# EAGLE schematic LIC_rack_BB-01 (EAGLE 7.2.0)
AUTHOR: M. Petrilak; VERSION: 00

## Sheet 1 of 4
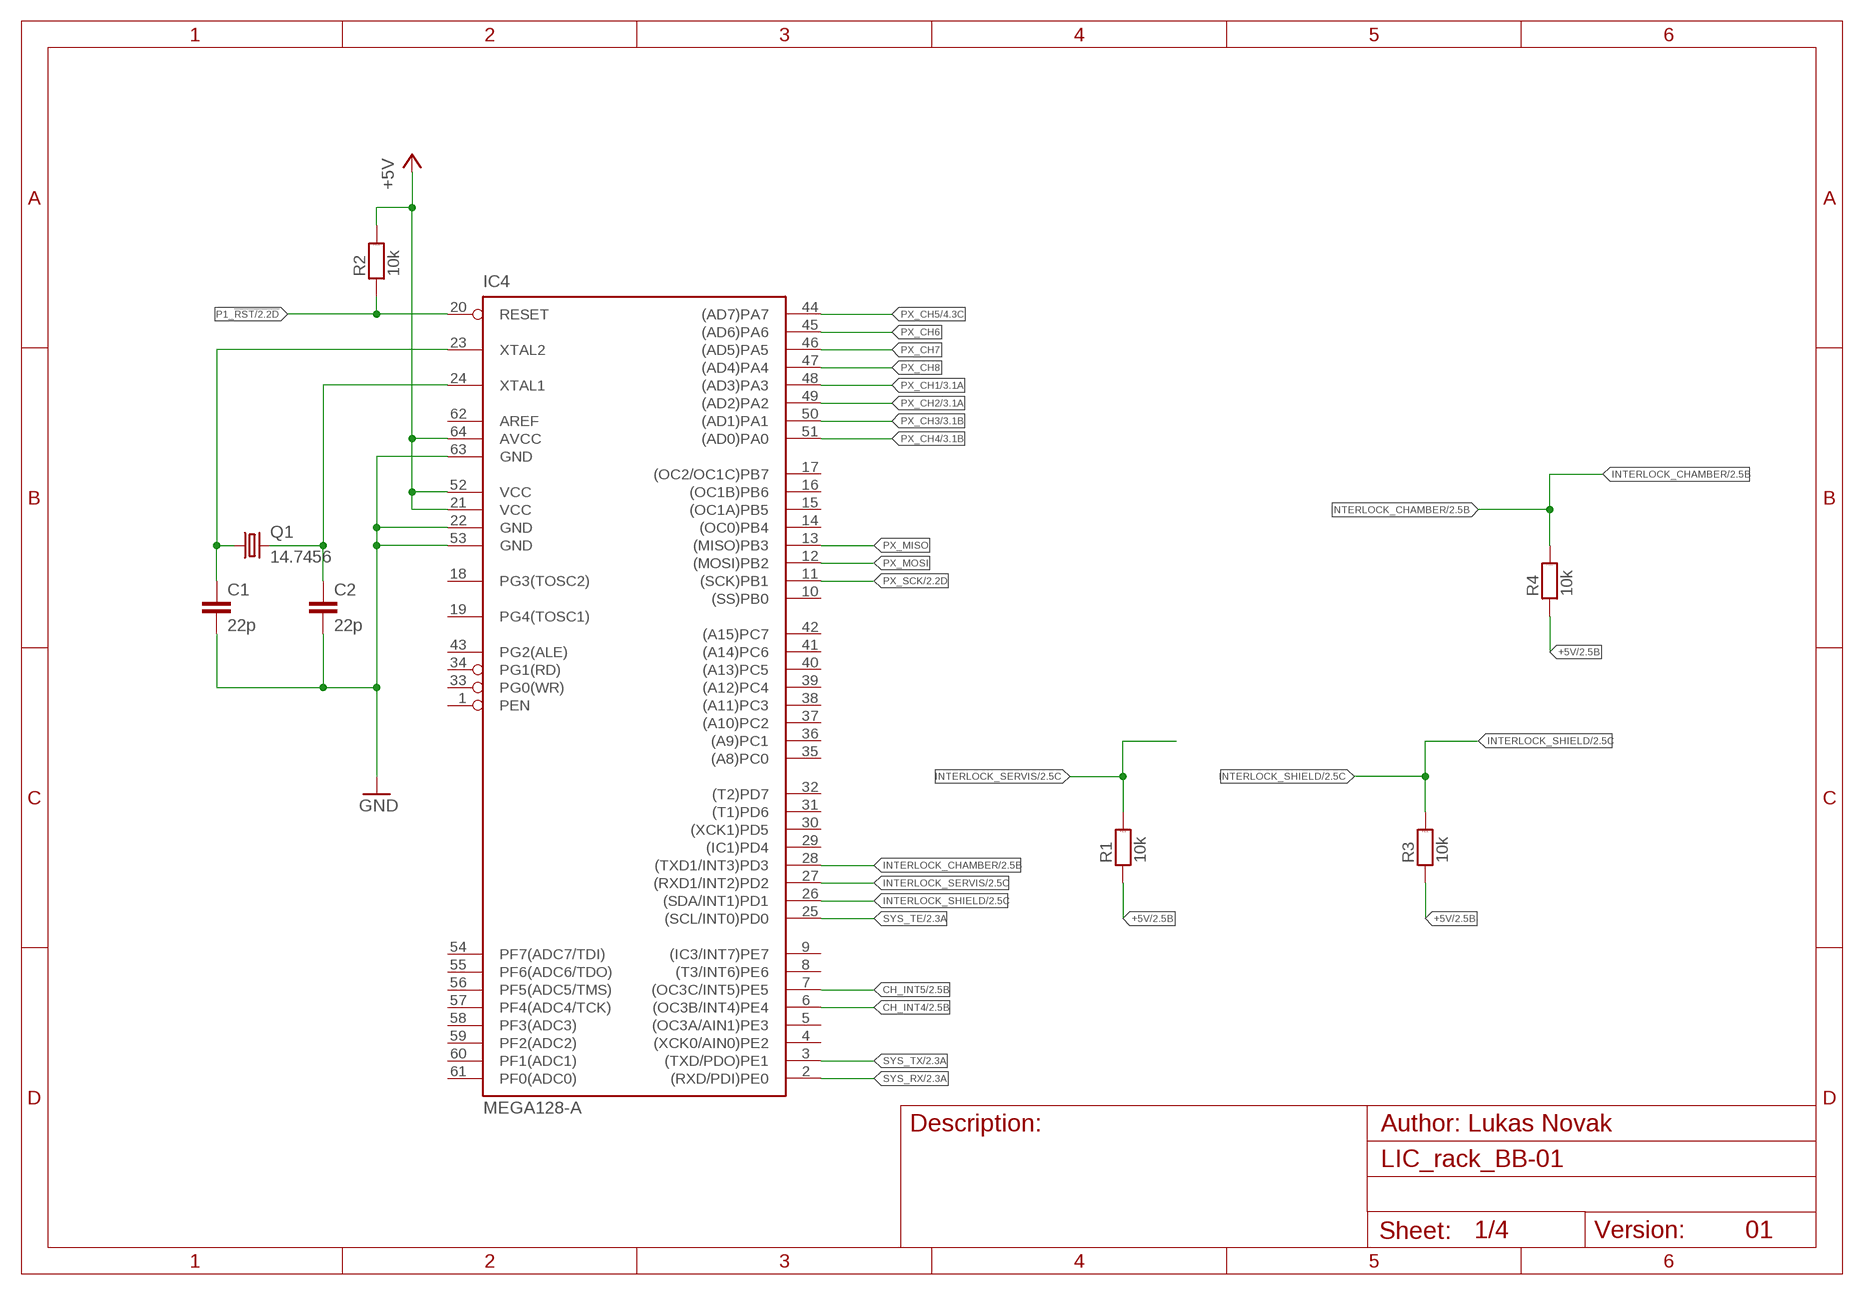
[diagram p0: schematic, sheet 1]

### Parts
C1  22p  C-EUC0805  [C0805]
C2  22p  C-EUC0805  [C0805]
IC4  MEGA128-A  [TQFP64]
Q1  14.7456  XTAL  [HC49U70]
R1  10k  R_1206  [1206]
R2  10k  R_1206  [1206]
R3  10k  R_1206  [1206]
R4  10k  R_1206  [1206]

### Nets
+5V: IC4.21(VCC) IC4.52(VCC) IC4.64(AVCC) R1.1 R2.2 R3.1 R4.1 ; also sheet 2,3,4
CH_INT4: IC4.6((OC3B/INT4)PE4) ; also sheet 2,3
CH_INT5: IC4.7((OC3C/INT5)PE5) ; also sheet 2
CLK1: C1.1 IC4.23(XTAL2) Q1.1
GND: C1.2 C2.2 IC4.22(GND) IC4.53(GND) IC4.63(GND) ; also sheet 2,3,4
INTERLOCK_CHAMBER: IC4.28((TXD1/INT3)PD3) R4.2 ; also sheet 2,3
INTERLOCK_SERVIS: IC4.27((RXD1/INT2)PD2) R1.2 ; also sheet 2
INTERLOCK_SHIELD: IC4.26((SDA/INT1)PD1) R3.2 ; also sheet 2
N$5: C2.1 IC4.24(XTAL1) Q1.2
P1_!RST: IC4.20(RESET) R2.1 ; also sheet 2
PX_CH1: IC4.48((AD3)PA3) ; also sheet 3
PX_CH2: IC4.49((AD2)PA2) ; also sheet 3
PX_CH3: IC4.50((AD1)PA1) ; also sheet 3
PX_CH4: IC4.51((AD0)PA0) ; also sheet 3
PX_CH5: IC4.44((AD7)PA7) ; also sheet 4
PX_CH6: IC4.45((AD6)PA6)
PX_CH7: IC4.46((AD5)PA5)
PX_CH8: IC4.47((AD4)PA4)
PX_MISO: IC4.13((MISO)PB3)
PX_MOSI: IC4.12((MOSI)PB2)
PX_SCK: IC4.11((SCK)PB1) ; also sheet 2
SYS_RX: IC4.2((RXD/PDI)PE0) ; also sheet 2
SYS_TE: IC4.25((SCL/INT0)PD0) ; also sheet 2
SYS_TX: IC4.3((TXD/PDO)PE1) ; also sheet 2
Unconnected: IC4.1(PEN) IC4.4((XCK0/AIN0)PE2) IC4.5((OC3A/AIN1)PE3) IC4.8((T3/INT6)PE6) IC4.9((IC3/INT7)PE7) IC4.10((SS)PB0) IC4.14((OC0)PB4) IC4.15((OC1A)PB5) IC4.16((OC1B)PB6) IC4.17((OC2/OC1C)PB7) IC4.18(PG3(TOSC2)) IC4.19(PG4(TOSC1)) IC4.29((IC1)PD4) IC4.30((XCK1)PD5) IC4.31((T1)PD6) IC4.32((T2)PD7) IC4.33(PG0(WR)) IC4.34(PG1(RD)) IC4.35((A8)PC0) IC4.36((A9)PC1) IC4.37((A10)PC2) IC4.38((A11)PC3) IC4.39((A12)PC4) IC4.40((A13)PC5) IC4.41((A14)PC6) IC4.42((A15)PC7) IC4.43(PG2(ALE)) IC4.54(PF7(ADC7/TDI)) IC4.55(PF6(ADC6/TDO)) IC4.56(PF5(ADC5/TMS)) IC4.57(PF4(ADC4/TCK)) IC4.58(PF3(ADC3)) IC4.59(PF2(ADC2)) IC4.60(PF1(ADC1)) IC4.61(PF0(ADC0)) IC4.62(AREF)

### Notes on the sheet
- 01

## Sheet 2 of 4
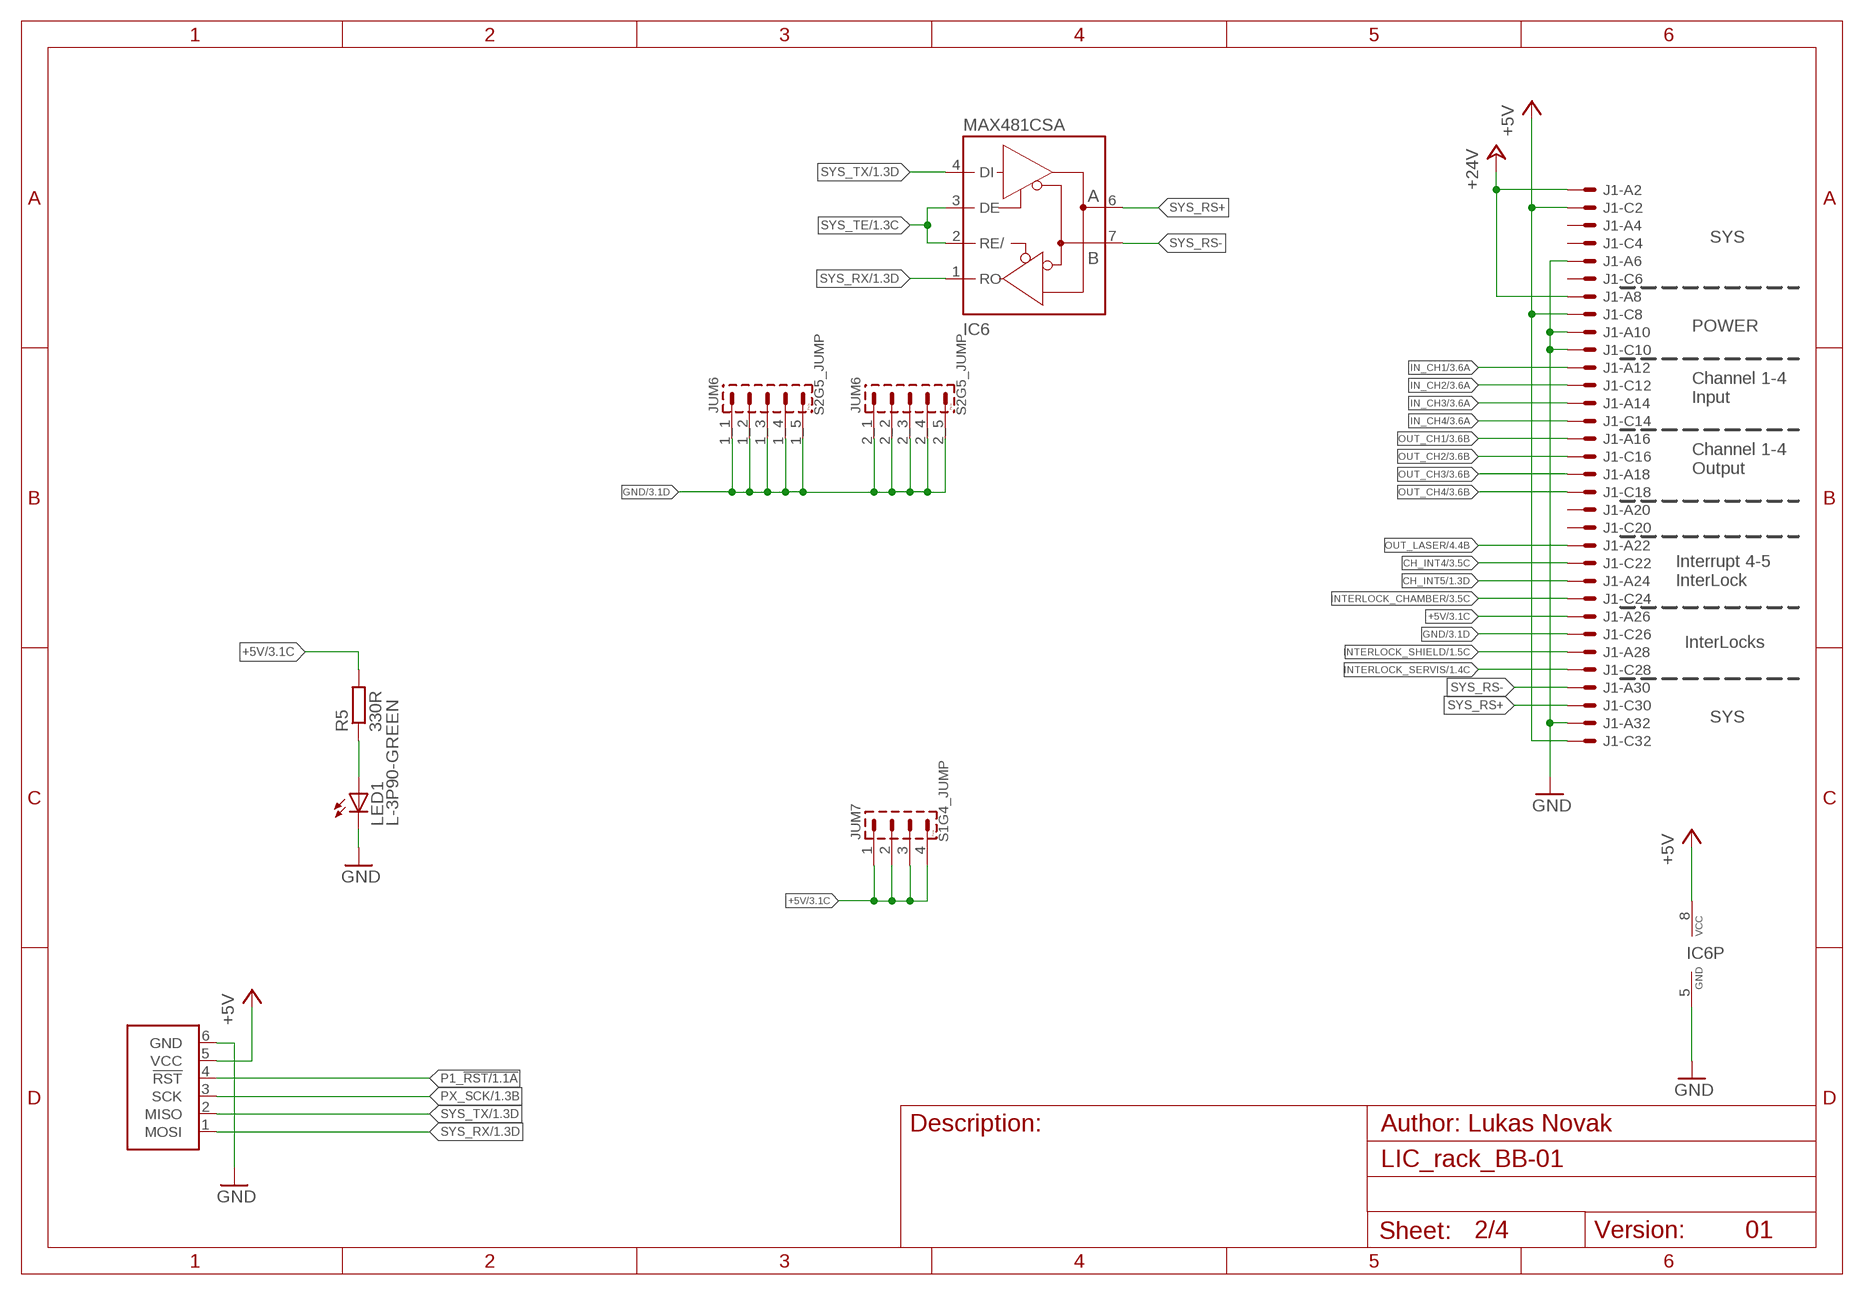
[diagram p1: schematic, sheet 2]

### Parts
IC6  MAX481CSA  [SO08]
J1  VG32SP  [VG32P]
JUM6  S2G5_JUMP  [S2G5_JUM]
JUM7  S1G4_JUMP  [S1G4_JUM]
LED1  L-3P90-GREEN  [L-3P90]
R5  330R  R-EU_R1206  [R1206]
U1  ATPROG-V  [6410-06]

### Nets
+5V: IC6.8(VCC) J1.A26 J1.C2 J1.C8 J1.C32 JUM7.1 JUM7.2 JUM7.3 JUM7.4 R5.2 U1.5(VCC) ; also sheet 1,3,4
+24V: J1.A2 J1.A8
CH_INT4: J1.C22 ; also sheet 1,3
CH_INT5: J1.A24 ; also sheet 1
GND: IC6.5(GND) J1.A6 J1.A10 J1.A32 J1.C10 J1.C26 JUM6.1_1 JUM6.1_2 JUM6.1_3 JUM6.1_4 JUM6.1_5 JUM6.2_1 JUM6.2_2 JUM6.2_3 JUM6.2_4 JUM6.2_5 LED1.K(C) U1.6(GND) ; also sheet 1,3,4
IN_CH1: J1.A12 ; also sheet 3
IN_CH2: J1.C12 ; also sheet 3
IN_CH3: J1.A14 ; also sheet 3
IN_CH4: J1.C14 ; also sheet 3
INTERLOCK_CHAMBER: J1.C24 ; also sheet 1,3
INTERLOCK_SERVIS: J1.C28 ; also sheet 1
INTERLOCK_SHIELD: J1.A28 ; also sheet 1
N$2: LED1.A R5.1
OUT_CH1: J1.A16 ; also sheet 3
OUT_CH2: J1.C16 ; also sheet 3
OUT_CH3: J1.A18 ; also sheet 3
OUT_CH4: J1.C18 ; also sheet 3
OUT_LASER: J1.A22 ; also sheet 4
P1_!RST: U1.4(!RST) ; also sheet 1
PX_SCK: U1.3(SCK) ; also sheet 1
SYS_RS+: IC6.6(A) J1.C30
SYS_RS-: IC6.7(B) J1.A30
SYS_RX: IC6.1(RO) U1.1(MOSI) ; also sheet 1
SYS_TE: IC6.2(RE/) IC6.3(DE) ; also sheet 1
SYS_TX: IC6.4(DI) U1.2(MISO) ; also sheet 1
Unconnected: J1.A4 J1.A20 J1.C4 J1.C6 J1.C20

### Notes on the sheet
- SYS
- POWER
- Channel 1-4
  Input
- Channel 1-4
  Output
- Interrupt 4-5
  InterLock
- InterLocks
- SYS
- 01

## Sheet 3 of 4
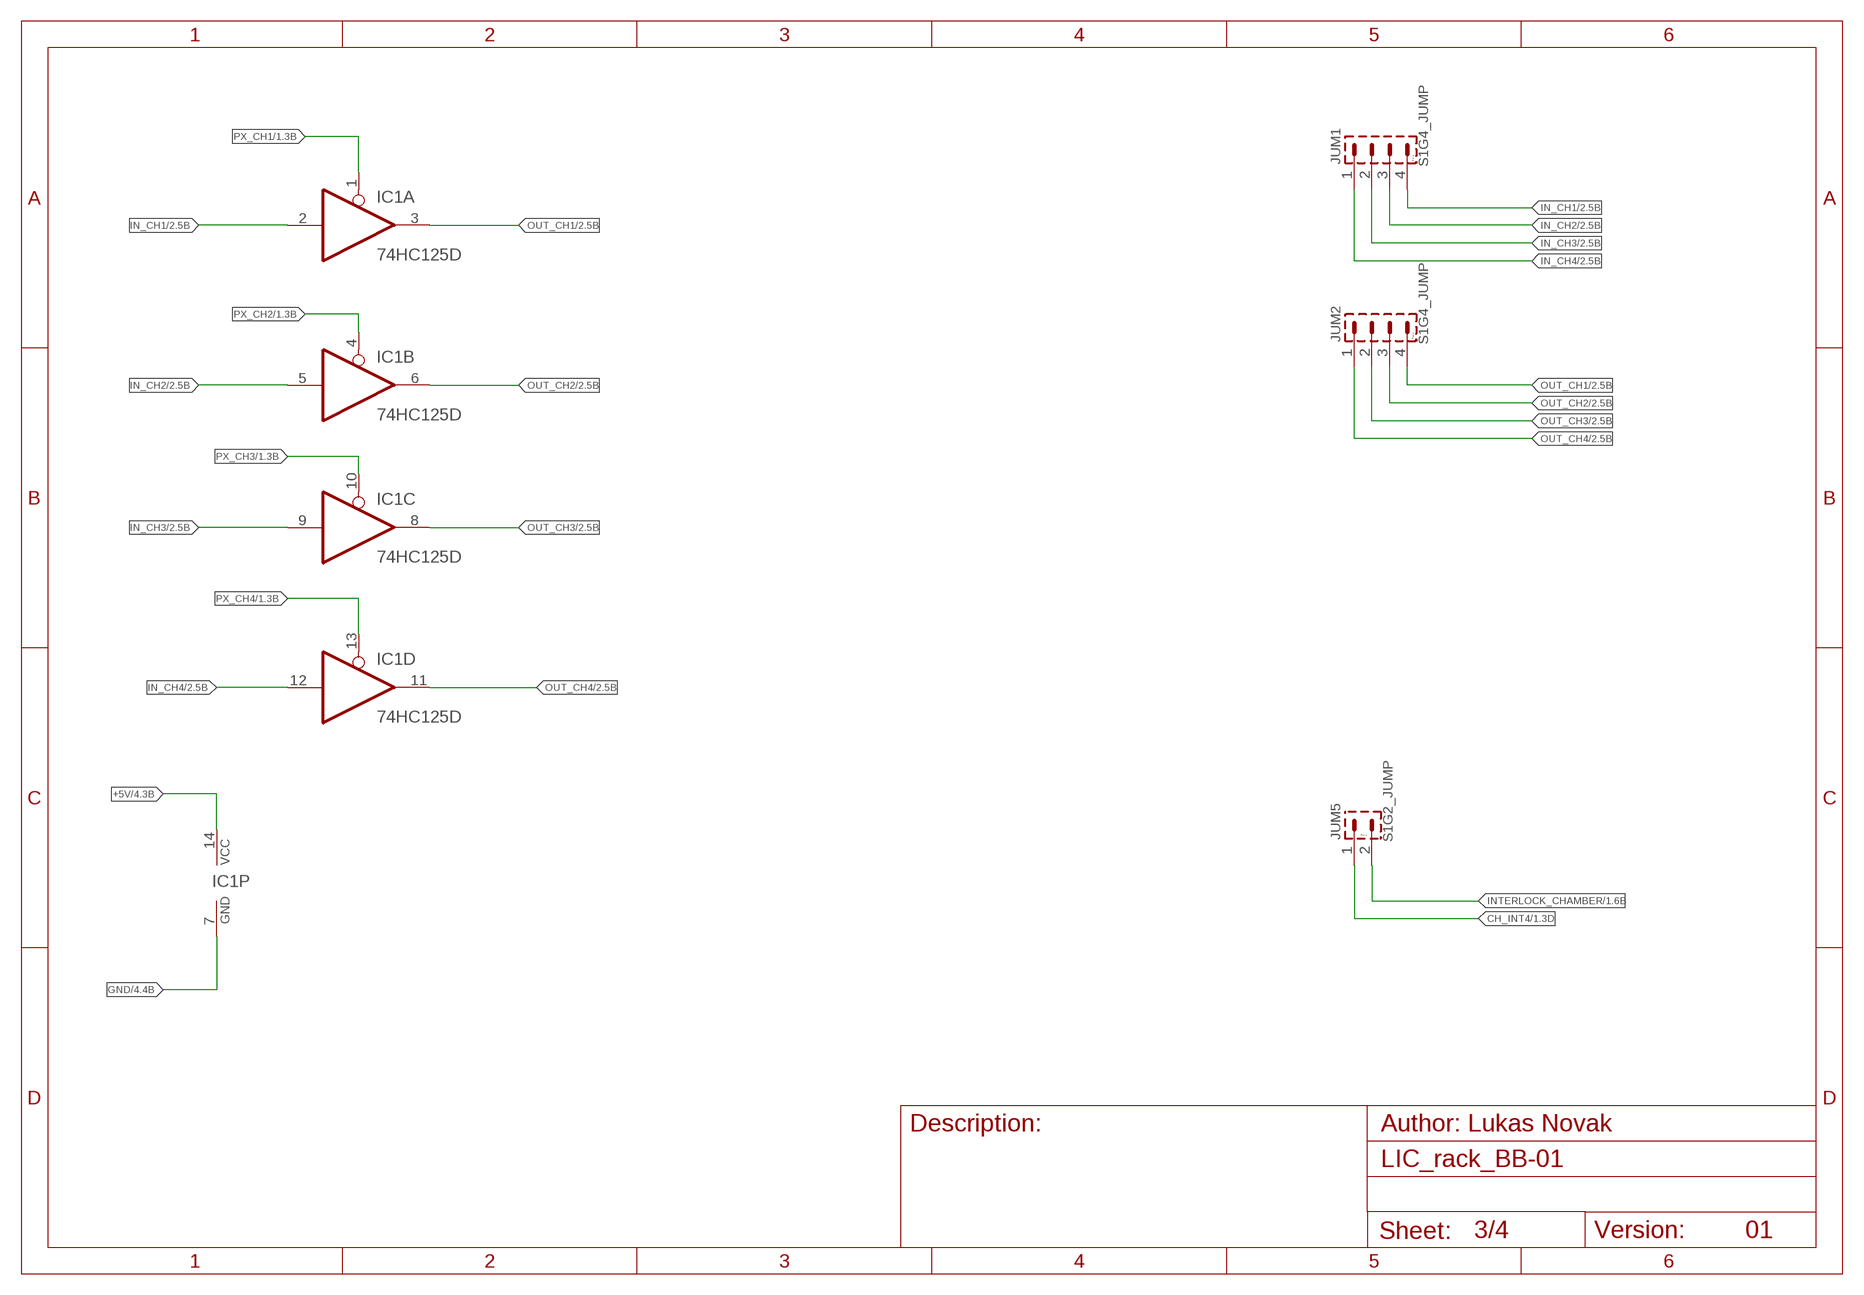
[diagram p2: schematic, sheet 3]

### Parts
IC1  74HC125D  [SO14]
JUM1  S1G4_JUMP  [S1G4_JUM]
JUM2  S1G4_JUMP  [S1G4_JUM]
JUM5  S1G2_JUMP  [S1G2_JUM]

### Nets
+5V: IC1.14(P:VCC) ; also sheet 1,2,4
CH_INT4: JUM5.1 ; also sheet 1,2
GND: IC1.7(P:GND) ; also sheet 1,2,4
IN_CH1: IC1.2(A:I) JUM1.4 ; also sheet 2
IN_CH2: IC1.5(B:I) JUM1.3 ; also sheet 2
IN_CH3: IC1.9(C:I) JUM1.2 ; also sheet 2
IN_CH4: IC1.12(D:I) JUM1.1 ; also sheet 2
INTERLOCK_CHAMBER: JUM5.2 ; also sheet 1,2
OUT_CH1: IC1.3(A:O) JUM2.4 ; also sheet 2
OUT_CH2: IC1.6(B:O) JUM2.3 ; also sheet 2
OUT_CH3: IC1.8(C:O) JUM2.2 ; also sheet 2
OUT_CH4: IC1.11(D:O) JUM2.1 ; also sheet 2
PX_CH1: IC1.1(A:OE) ; also sheet 1
PX_CH2: IC1.4(B:OE) ; also sheet 1
PX_CH3: IC1.10(C:OE) ; also sheet 1
PX_CH4: IC1.13(D:OE) ; also sheet 1

### Notes on the sheet
- 01

## Sheet 4 of 4
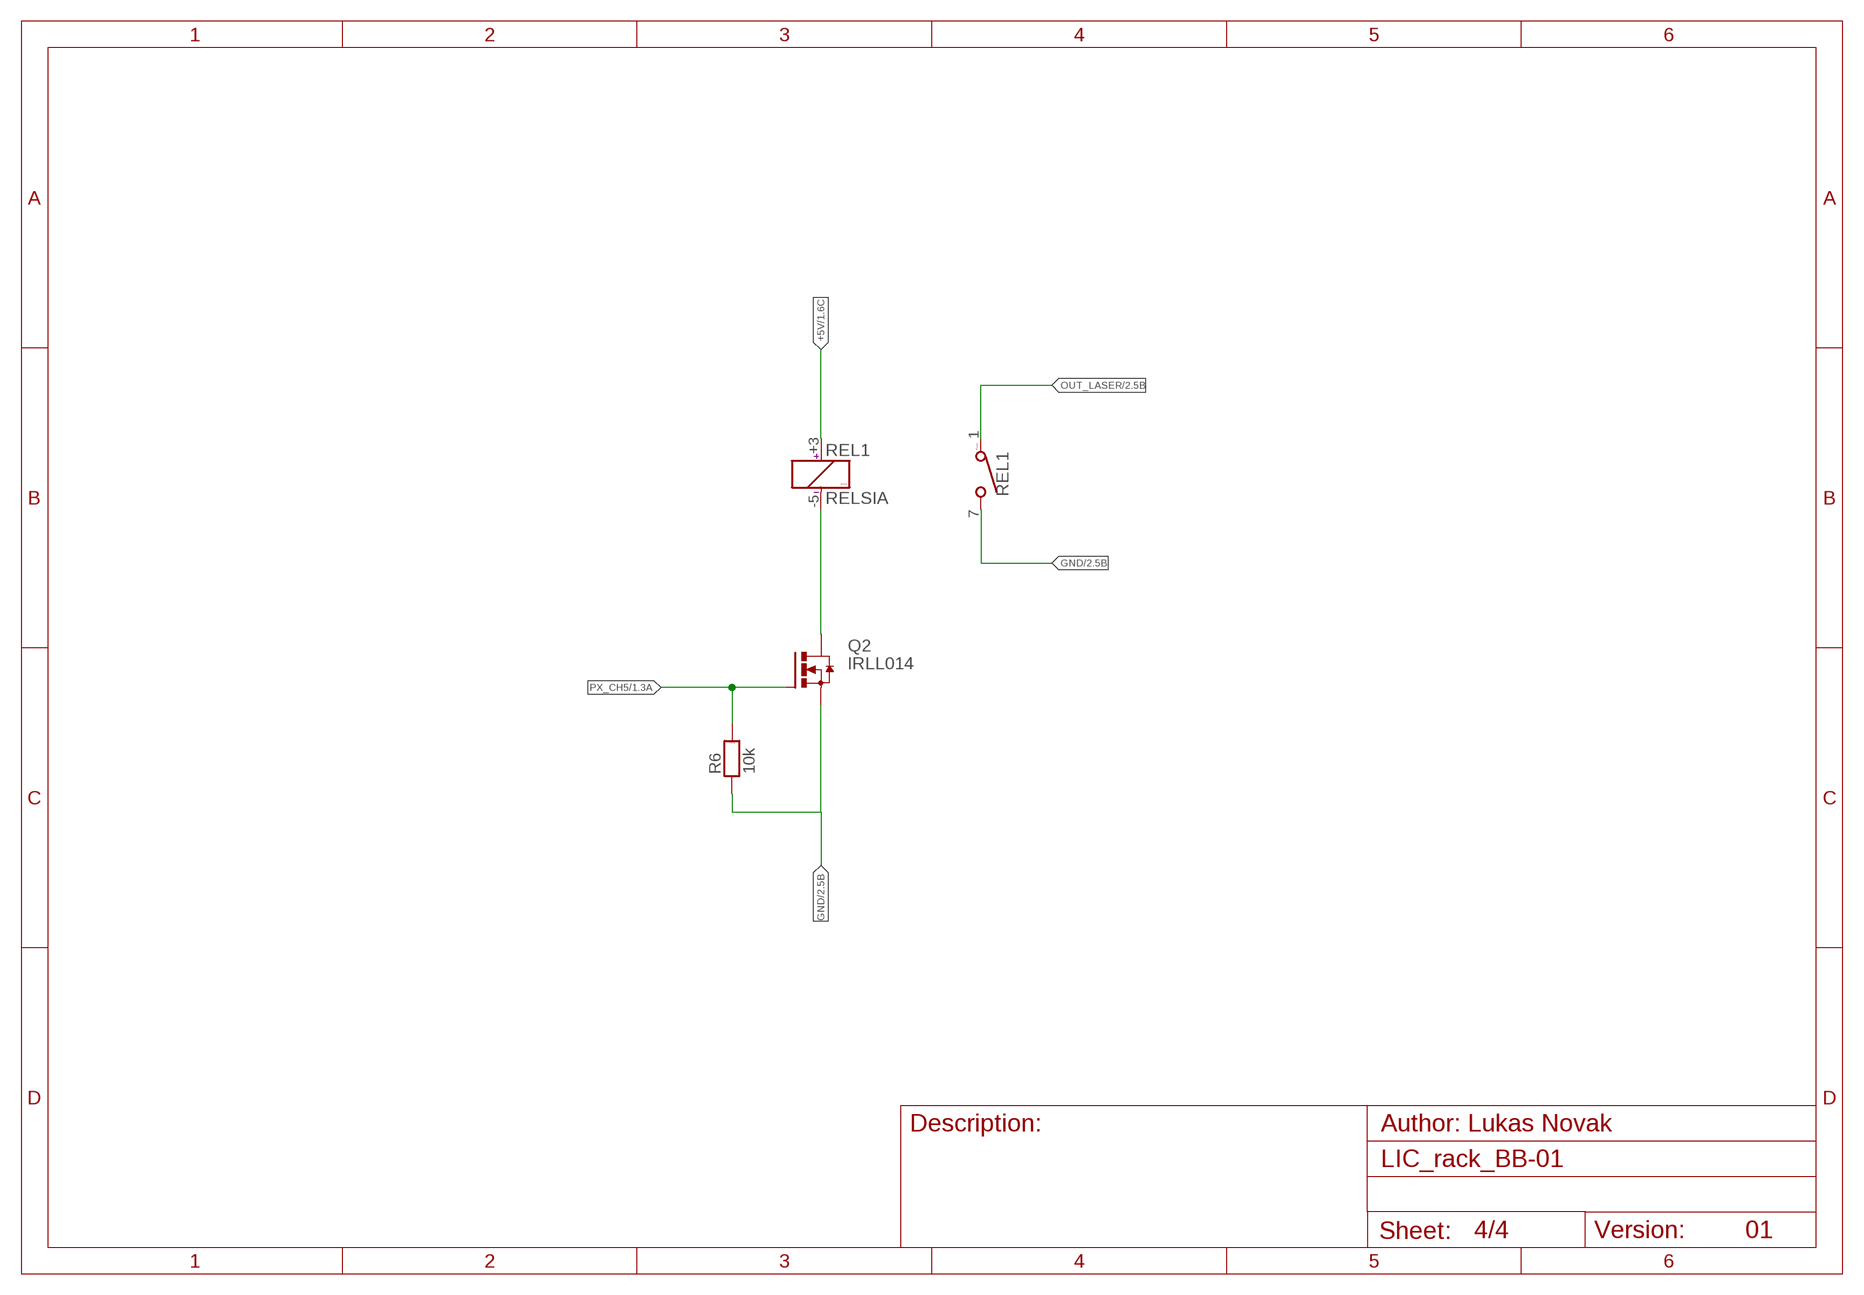
[diagram p3: schematic, sheet 4]

### Parts
Q2  IRLL014  N-HEXFET-2D_SOT232-  [SOT223]
R6  10k  R_1206  [1206]
REL1  RELSIA  [RELSIA]

### Nets
+5V: REL1.+3(CIVKA:C+) ; also sheet 1,2,3
GND: Q2.3(S) R6.1 REL1.7 ; also sheet 1,2,3
N$3: Q2.2(D) Q2.4(D) REL1.-5(CIVKA:C-)
OUT_LASER: REL1.1 ; also sheet 2
PX_CH5: Q2.1(G) R6.2 ; also sheet 1

### Notes on the sheet
- 01

## Library data of the parts
C1 C2 = rcl:C-EU: CAPACITOR, European symbol
IC1 = 74xx-eu:74*125: Quad bus BUFFER, 3-state
IC4 = atmel:MEGA128: MICROCONTROLLER 128 Kbytes FLASH 4 Kbytes SRAM 4 Kbytes EEPROM DUAL USART 8-channel 10 bit ADC Source: avr.lbr; MPN: ATMEGA128-16AU; OC_FARNELL: 9171118; OC_NEWARK: 95K7364
IC6 = maxim:MAX481CSA: RS485 TRANSEIVER
J1 = 19inch:VG32S: PCB EUROCARD, 32-pin type C/AC, 5.08 mm
JUM1 JUM2 JUM7 = #PaJa_konektory:S1G4_JUMP: Radove konektory - koliky - 4x
JUM5 = #PaJa_konektory:S1G2_JUMP: Radove konektory - koliky - 2x
JUM6 = #PaJa_konektory:S2G5_JUMP: Radove konektory - koliky - dvojite - 2x5
LED1 = led:L-3P90
Q1 = crystal:XTAL
Q2 = transistor-power:N-HEXFET-2D_?-*: HEXFET® Power MOSFET 2 Drain connects http://www.irf.com/product-info/datasheets/data/irll014n.pdf
R1-R4 R6 = #PaJa_31:R: Rezistor
R5 = rcl:R-EU_: RESISTOR, European symbol
REL1 = #PaJa_31:RELSIA??: RELE - 1x spinaci, 5V, 12V, 24V max. spinany proud = 0,5A
U1 = con-molex:ATPROG